# Altium schematic sheet Mako DSP SD Card and MIDI R2.1.SchDoc
size A
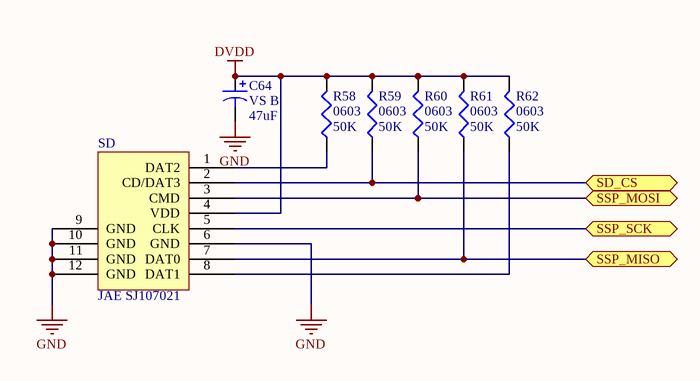
[diagram p0: Mako DSP SD Card and MIDI R2.1.SchDoc]

## Parts
C64  VS B  value 47uF  [Panasonic VS B]
R58  0603  value 50K  [J1-0603]
R59  0603  value 50K  [J1-0603]
R60  0603  value 50K  [J1-0603]
R61  0603  value 50K  [J1-0603]
R62  0603  value 50K  [J1-0603]
SD  JAE SJ107021  [JAE SJ107021]

## Ports
SD_CS, SSP_MISO, SSP_MOSI, SSP_SCK

## Nets
DVDD: C64.1 R58.2 R59.2 R60.2 R61.2 R62.2 SD.4(VDD)
GND: C64.2 SD.6(GND) SD.9(GND) SD.10(GND) SD.11(GND) SD.12(GND)
SD_CS: R59.1 SD.2(CD/DAT3) ; port SD_CS
SSP_MISO: R61.1 SD.7(DAT0) ; port SSP_MISO
SSP_MOSI: R60.1 SD.3(CMD) ; port SSP_MOSI
SSP_SCK: SD.5(CLK) ; port SSP_SCK
NetR58_1: R58.1 SD.1(DAT2)
NetR62_1: R62.1 SD.8(DAT1)

## Library data of the parts
C64 = Cap Pol1: Polarized Capacitor (Radial); Published: 8-Jun-2000; LatestRevisionDate: 17-Jul-2002; LatestRevisionNote: Re-released for DXP Platform.; PackageReference: RB7.6-15; Publisher: Altium Limited; PackageDescription: Polarized Capacitor (Radial); 2 Leads
R58-R62 = Res3: Resistor; Published: 8-Jun-2000; LatestRevisionDate: 29-May-2009; LatestRevisionNote: IPC-7351 Footprint Added.; PackageReference: J1-0603; Publisher: Altium Limited; PackageDescription: Chip Resistor
SD = JAE SJ107021 microSD Card Socket